# Altium schematic sheet S03-LEDS.SchDoc
size B; SheetNumber: 4; SheetTotal: 4; BLOCK-TITLE: LED ARRAY AND TACTILE SWITCHES; BLOCK-SIZE: B; BLOCK-PROJECT: MULTIMOD LED MODULE; BLOCK-REVISION: 1; BLOCK-ORGANIZATION: UNIVERSITY OF FLORIDA; BLOCK-DESIGNER: MEHRON TALEBI; BLOCK-IDENTIFIER: SUMMER 2023; BLOCK-REVIEWER: MIKE STAPLETON
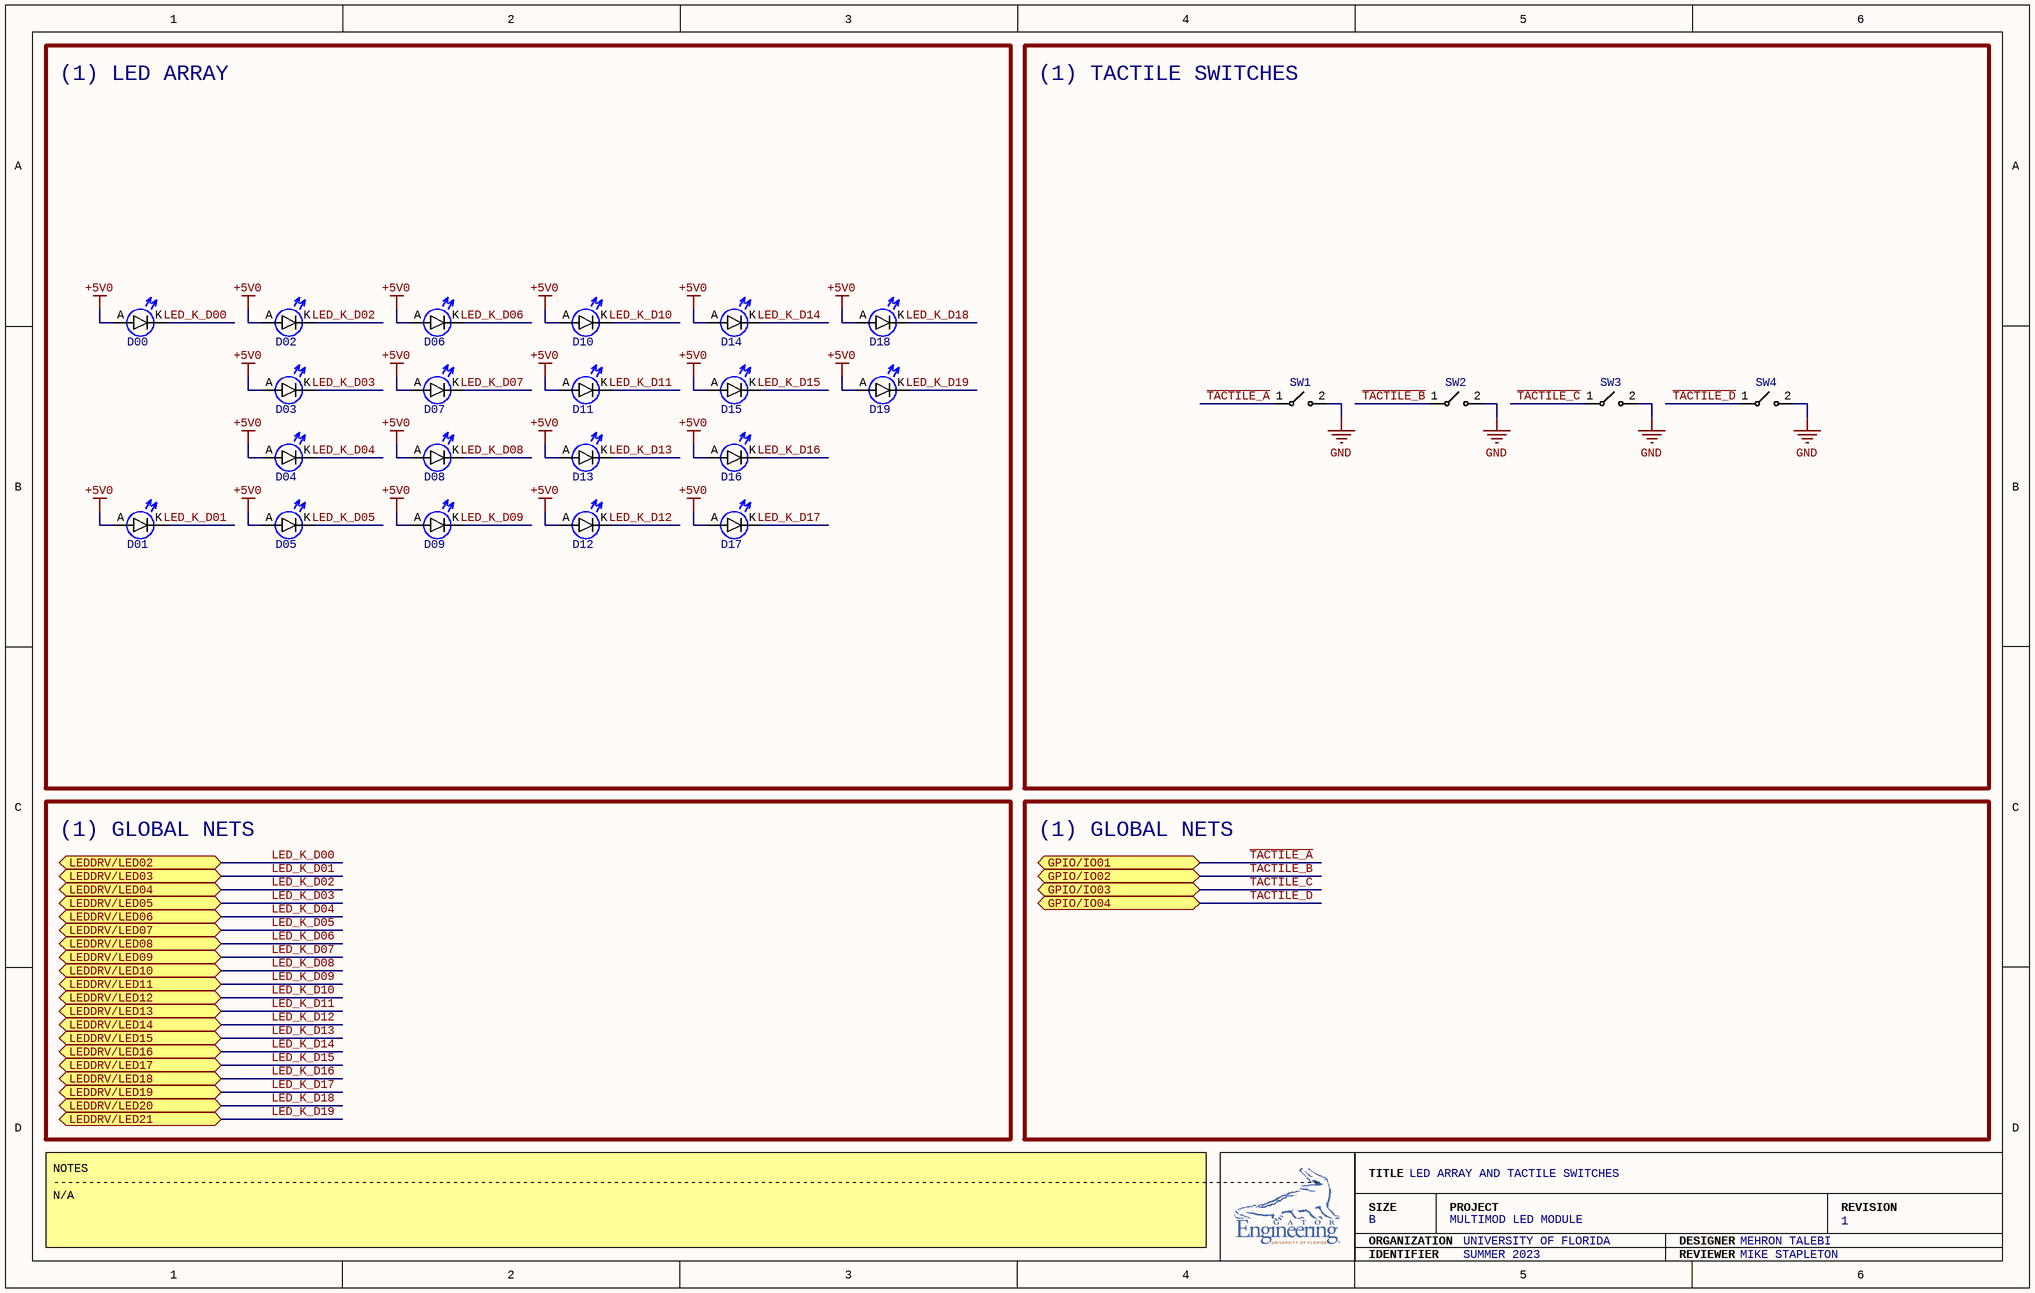
[diagram p0: S03-LEDS.SchDoc]

## Parts
D00  XZFBB45S-9  [XZFBB45S-9]  (value not drawn)
D01  XZFBB45S-9  [XZFBB45S-9]  (value not drawn)
D02  XZFBB45S-9  [XZFBB45S-9]  (value not drawn)
D03  XZFBB45S-9  [XZFBB45S-9]  (value not drawn)
D04  XZFBB45S-9  [XZFBB45S-9]  (value not drawn)
D05  XZFBB45S-9  [XZFBB45S-9]  (value not drawn)
D06  XZFBB45S-9  [XZFBB45S-9]  (value not drawn)
D07  XZFBB45S-9  [XZFBB45S-9]  (value not drawn)
D08  XZFBB45S-9  [XZFBB45S-9]  (value not drawn)
D09  XZFBB45S-9  [XZFBB45S-9]  (value not drawn)
D10  XZFBB45S-9  [XZFBB45S-9]  (value not drawn)
D11  XZFBB45S-9  [XZFBB45S-9]  (value not drawn)
D12  XZFBB45S-9  [XZFBB45S-9]  (value not drawn)
D13  XZFBB45S-9  [XZFBB45S-9]  (value not drawn)
D14  XZFBB45S-9  [XZFBB45S-9]  (value not drawn)
D15  XZFBB45S-9  [XZFBB45S-9]  (value not drawn)
D16  XZFBB45S-9  [XZFBB45S-9]  (value not drawn)
D17  XZFBB45S-9  [XZFBB45S-9]  (value not drawn)
D18  XZFBB45S-9  [XZFBB45S-9]  (value not drawn)
D19  XZFBB45S-9  [XZFBB45S-9]  (value not drawn)
SW1  TL9210AF260Q  [TL9210AF260Q]  (value not drawn)
SW2  TL9210AF260Q  [TL9210AF260Q]  (value not drawn)
SW3  TL9210AF260Q  [TL9210AF260Q]  (value not drawn)
SW4  TL9210AF260Q  [TL9210AF260Q]  (value not drawn)

## Blocks framed on the sheet
(1) LED ARRAY: D00 D01 D02 D03 D04 D05 D06 D07 D08 D09-D19
(1) TACTILE SWITCHES: SW1-SW4

## Ports
GPIO/IO01 (bidir), GPIO/IO02 (bidir), GPIO/IO03 (bidir), GPIO/IO04 (bidir), LEDDRV/LED02 (bidir), LEDDRV/LED03 (bidir), LEDDRV/LED04 (bidir), LEDDRV/LED05 (bidir), LEDDRV/LED06 (bidir), LEDDRV/LED07 (bidir), LEDDRV/LED08 (bidir), LEDDRV/LED09 (bidir), LEDDRV/LED10 (bidir), LEDDRV/LED11 (bidir), LEDDRV/LED12 (bidir), LEDDRV/LED13 (bidir), LEDDRV/LED14 (bidir), LEDDRV/LED15 (bidir), LEDDRV/LED16 (bidir), LEDDRV/LED17 (bidir), LEDDRV/LED18 (bidir), LEDDRV/LED19 (bidir), LEDDRV/LED20 (bidir), LEDDRV/LED21 (bidir)

## Nets
+5V0: D00.A D01.A D02.A D03.A D04.A D05.A D06.A D07.A D08.A D09.A D10.A D11.A D12.A D13.A D14.A D15.A D16.A D17.A D18.A D19.A
GND: SW1.2 SW2.2 SW3.2 SW4.2
~{TACTILE_A}: SW1.1 ; port GPIO/IO01
~{TACTILE_B}: SW2.1 ; port GPIO/IO02
~{TACTILE_C}: SW3.1 ; port GPIO/IO03
~{TACTILE_D}: SW4.1 ; port GPIO/IO04
LED_K_D00: D00.K ; port LEDDRV/LED02
LED_K_D01: D01.K ; port LEDDRV/LED03
LED_K_D02: D02.K ; port LEDDRV/LED04
LED_K_D03: D03.K ; port LEDDRV/LED05
LED_K_D04: D04.K ; port LEDDRV/LED06
LED_K_D05: D05.K ; port LEDDRV/LED07
LED_K_D06: D06.K ; port LEDDRV/LED08
LED_K_D07: D07.K ; port LEDDRV/LED09
LED_K_D08: D08.K ; port LEDDRV/LED10
LED_K_D09: D09.K ; port LEDDRV/LED11
LED_K_D10: D10.K ; port LEDDRV/LED12
LED_K_D11: D11.K ; port LEDDRV/LED13
LED_K_D12: D12.K ; port LEDDRV/LED14
LED_K_D13: D13.K ; port LEDDRV/LED15
LED_K_D14: D14.K ; port LEDDRV/LED16
LED_K_D15: D15.K ; port LEDDRV/LED17
LED_K_D16: D16.K ; port LEDDRV/LED18
LED_K_D17: D17.K ; port LEDDRV/LED19
LED_K_D18: D18.K ; port LEDDRV/LED20
LED_K_D19: D19.K ; port LEDDRV/LED21

## Notes on the sheet
- (1) GLOBAL NETS
- NOTES
  -------------------------------------------------------------------------------------------------------------------------------------------------------------------------------------
  N/A
- TITLE
- SIZE
- ORGANIZATION
- PROJECT
- DESIGNER
- REVISION
- IDENTIFIER
- REVIEWER

## Library data of the parts
D00 D01 D02 D03 D04 D05 D06 D07 D08 D09-D19 = XZFBB45S-9: LED BLUE CLEAR 2PLCC SMD; Configuration: Standard; Lens Color: Colorless; Millicandela Rating: 447mcd; Lens Style: Round with Flat Top; Lens Size: 2.40mm Dia; Voltage - Forward (Vf) (Typ): 3.3V; Current - Test: 20mA; Viewing Angle: 120°; Wavelength - Dominant: 470nm; Wavelength - Peak: 465nm; Color: Blue; Lens Transparency: Clear; Mounting Type: Surface Mount, Bottom Entry; Package / Case: 2-SMD, Z-Bend; Supplier Device Package: 2-PLCC; Size / Dimension: 3.20mm L x 2.80mm W; Height (Max): 1.90mm; Supplier 1: Digi-Key; Supplier Part Number 1: 1497-1233-1-ND
SW1-SW4 = TL9210AF260Q: SWITCH TACTILE SPST-NO 0.05A 12V; Switch Function: Off-Mom; Contact Rating @ Voltage: 0.05A @ 12VDC; Actuator Type: Round Button; Actuator Height off PCB, Vertical: 5.00mm; Actuator Orientation: Top Actuated; Outline: 6.00mm x 6.00mm; Illumination: Non-Illuminated; Operating Force: 260gf; Switch Travel: 1.30mm; Mechanical Life: 100,000 Cycles; Circuit: SPST-NO; Mounting Type: Surface Mount; Termination Style: J Lead; Operating Temperature: -20°C ~ 70°C; Supplier 1: Digi-Key; Supplier Part Number 1: EG2664CT-ND